# EasyEDA Pro project WaterInfo.eprj

# Schematic 水质信息采集装置原理图
Board Name: 集成原理图; Create Date: 2025-05-13; Page Name: P1; Project Name: WaterInfo; Schematic Name: 水质信息采集装置原理图; Update Date: 2025-05-13; Company: 嘉立创EDA; Drawed: 何宇鹏; Page Size: A4; Version: V2.3
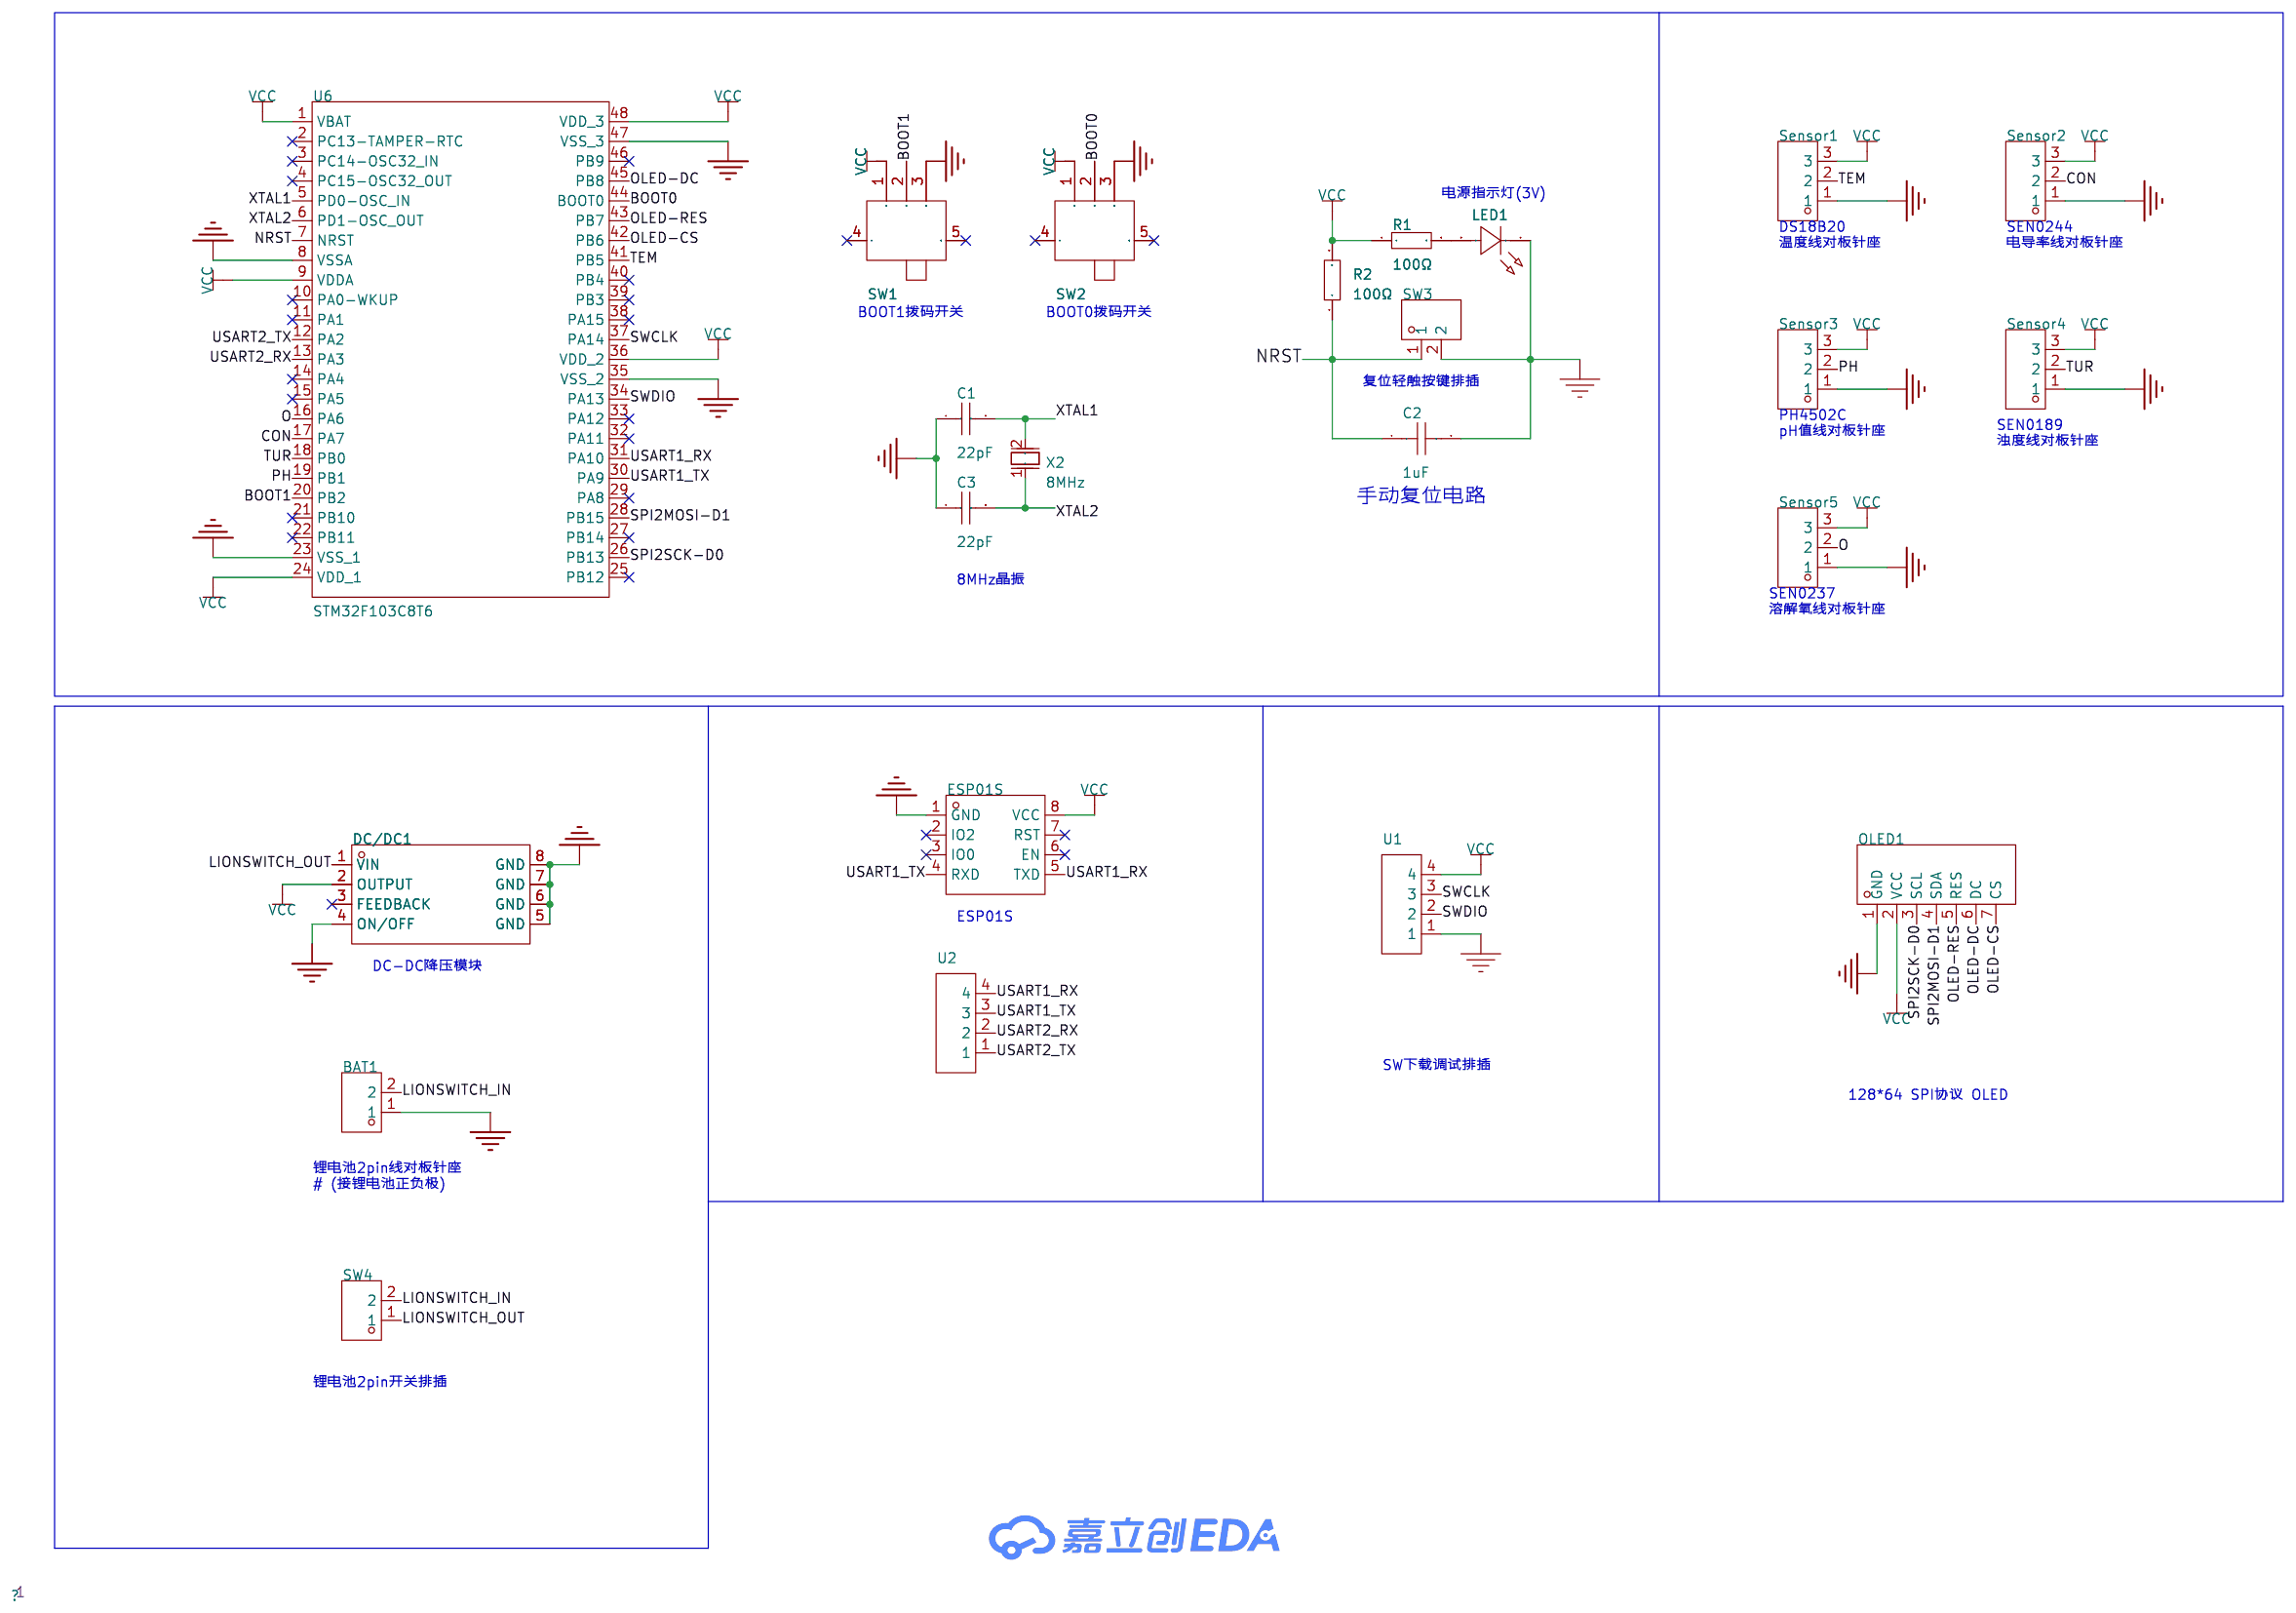
[diagram p0: schematic sheet]

## Parts
BAT1  WAFER-PH2.0-2PZZ  [CONN-TH_2P-P2.00_HC-PH-2A-M]
C1  22pF  [C0603]
C2  1uF  [C0603]
C3  22pF  [C0603]
DC/DC1  XL1509-3.3  [SOIC-8_L4.9-W3.9-P1.27-LS6.0-BL]
ESP01S  2.4GHz  [WIFIM-TH_8P-L24.7-W14.4-P2.54]
LED1  XL-502UGD  [LED-TH_BD5.9-P2.54-RD_GREEN]
OLED1  HS96L01W4S03  [OLED-TH_HS96L01W4S03]
R1  100Ω  [R0805]
R2  100Ω  [R0805]
Sensor1  2.54-1*3P  [CONN-TH_C722693]
Sensor2  WAFER-PH2.0-3PZZ  [CONN-TH_PH2.0D-L-3P]
Sensor3  2.54-1*3P  [CONN-TH_C722693]
Sensor4  WAFER-PH2.0-3PZZ  [CONN-TH_PH2.0D-L-3P]
Sensor5  2.54-1*3P  [CONN-TH_C722693]
SW1  MINI MSK12CO2  [SW-SMD_MSK12CO2]
SW2  MINI MSK12CO2  [SW-SMD_MSK12CO2]
SW3  WAFER-PH2.0-2PZZ  [CONN-TH_2P-P2.00_HC-PH-2A-M]
SW4  WAFER-PH2.0-2PZZ  [CONN-TH_2P-P2.00_HC-PH-2A-M]
U1  HX PZ2.54-1x4P ZZ  [HDR-TH_4P-P2.54-V-M]
U2  HX PZ2.54-1x4P ZZ  [HDR-TH_4P-P2.54-V-M]
U6  STM32F103C8T6  [LQFP-48_L7.0-W7.0-P0.50-LS9.0-BL]
X2  8MHz  [OSC-SMD_2P-L3.2-W2.5]

## Library data of the parts
BAT1 SW3 SW4 = WAFER-PH2.0-2PZZ: LCSC Part Name: 1x2P 间距:2mm 直插 系列:PH; Supplier Part: C5359599; Manufacturer: XUNPU(讯普); Supplier Footprint: 插件,P=2mm; JLCPCB Part Class: 扩展库; Datasheet: https://atta.szlcsc.com/upload/public/pdf/source/20241108/09B74E94153224768C62B7F095CB8C18.pdf; Supplier: LCSC; Pins Structure: 1x2P; Pitch: 2mm; Mounting Type: 直插; Reference Series: PH; Number of Pins: 2P; Number of Rows: 1; Number of PINs Per Row: 2; Current Rating: 2A; Contact Material: 黄铜; Contact Plating: 锡; Operating Temperature: -25℃~+85℃; Voltage Rating: 250V; Plastic Material: PA66; Flame Retardant Rating: UL94V-0; Color: 白色; Z-Height of the Board: 6.05mm; X-Length of Bottom Edge on Board (Spacing Line): 6mm; Y-Width of Bottom Edge on Board: 4.7mm
C1 C3 = CL10C220JB8NNNC: LCSC Part Name: 22pF ±5% 50V; Supplier Part: C1653; Manufacturer: SAMSUNG(三星); Supplier Footprint: 0603; JLCPCB Part Class: 基础库; Datasheet: https://atta.szlcsc.com/upload/public/pdf/source/20160218/1457707763339.pdf; Supplier: LCSC; Tolerance: ±5%; Voltage Rated: 50V; Temperature Coefficient: C0G
C2 = CL10A105KB8NNNC: LCSC Part Name: 1uF ±10% 50V; Supplier Part: C15849; Manufacturer: SAMSUNG(三星); Supplier Footprint: 0603; JLCPCB Part Class: 基础库; Datasheet: https://atta.szlcsc.com/upload/public/pdf/source/20160218/1457707763339.pdf; Supplier: LCSC; Tolerance: ±10%; Voltage Rated: 50V; Temperature Coefficient: X5R
DC/DC1 = XL1509-3.3: LCSC Part Name: 150 KHz 固定频率 PWM 降压 DC/DC 转换器; Supplier Part: C2681226; Manufacturer: UMW(友台半导体); Supplier Footprint: SOP-8; JLCPCB Part Class: 扩展库; Datasheet: https://atta.szlcsc.com/upload/public/pdf/source/20241113/D9907419AB21EE12D855D7DFAFDDCB19.pdf; Supplier: LCSC; Function: 降压型; Output Type: 固定; Input Voltage: 4.5V~40V; Output Voltage: 3.3V; Output Current: 2A; Switching Frequency: 150kHz; Operating Temperature: -40℃~+125℃@(TJ); Synchronous Rectification: 否; Number of Outputs: 1; Topology: 降压式; Quiescent Current (Iq): 150uA; Switch tube (built-in/external): 内置
ESP01S = ESP-01S: LCSC Part Name: 完整的802.11b/g/nWi-FiSoC模块; Supplier Part: C503582; Manufacturer: Ai-Thinker(安信可); JLCPCB Part Class: 扩展库; Datasheet: https://atta.szlcsc.com/upload/public/pdf/source/20200407/C503582_1139AF8FB42E05635FA0089E1752A536.pdf; Supplier: LCSC; Core Processor: ESP8266芯片; Support Interface: GPIO；UART；PWM; Antenna Type: 板载PCB天线; Output Power: 16dBm; Operating Voltage: 3V~3.6V; Receive  Current: 56mA; Send  Current: 170mA; Sensitivity: -90dBm; Operating Temperature: -20℃~+70℃
LED1 = XL-502UGD: Supplier Part: C2895548; Manufacturer: XINGLIGHT(成兴光); Supplier Footprint: 插件,D=5mm; JLCPCB Part Class: 扩展库; Datasheet: https://atta.szlcsc.com/upload/public/pdf/source/20240112/069024ED60A10A0E09F0F24A9490946D.pdf; Supplier: LCSC; Lamp Holder Type: 5mm圆形灯头; Illumination Color: 翠绿色; Voltage - Forward(Vf): 3V; Power(Watts): 70mW; Forward Current: 20mA; Wavelength - Dominant: 520nm~530nm; Peak Wavelength: 520nm; Lens Color: 绿色透镜; Luminous Intensity: 12000mcd; Operating Temperature: -25℃~+85℃
OLED1 = HS96L01W4S03: LCSC Part Name: 0.96寸 白光 128x64像素分辨率; Supplier Part: C5139758; Manufacturer: HS(汉昇); JLCPCB Part Class: 扩展库; Datasheet: https://atta.szlcsc.com/upload/public/pdf/source/20231102/B1697FD352320B8236C71C910449C6BA.pdf; Supplier: LCSC
R1 R2 = RT0805BRD07100RL: LCSC Part Name: 薄膜电阻 100Ω ±0.1% 125mW; Supplier Part: C110773; Manufacturer: YAGEO(国巨); Supplier Footprint: 0805; JLCPCB Part Class: 扩展库; Datasheet: https://atta.szlcsc.com/upload/public/pdf/source/20171113/C136918_15105611010051115495.pdf; Supplier: LCSC; Type: 薄膜电阻; Tolerance: ±0.1%; Power(Watts): 125mW; Overload Voltage (Max): 150V; Temperature Coefficient: ±25ppm/℃; Operating Temperature Range: -55℃~+155℃
Sensor1 Sensor3 Sensor5 = 2.54-1*3P: LCSC Part Name: 1x3P 间距:2.5mm 直插; Supplier Part: C722693; Manufacturer: CAX(创都); Supplier Footprint: 插件,P=2.5mm; JLCPCB Part Class: 扩展库; Datasheet: https://atta.szlcsc.com/upload/public/pdf/source/20200828/C722882_77827A18A6E0E346E9D9EABFEFB0E3A6.pdf; Supplier: LCSC; Pins Structure: 1x3P; Pitch: 2.5mm; Mounting Style: 直插; Number of Pins: 3P; Number of Rows: 1; Number of PINs Per Row: 3; Current Rating (Max): 2A; Operating Temperature Range: -25℃~+85℃
Sensor2 Sensor4 = WAFER-PH2.0-3PZZ: LCSC Part Name: 1x3P 间距:2mm 直插 系列:PH; Supplier Part: C5359600; Manufacturer: XUNPU(讯普); Supplier Footprint: 插件,P=2mm; JLCPCB Part Class: 扩展库; Datasheet: https://atta.szlcsc.com/upload/public/pdf/source/20241108/09B74E94153224768C62B7F095CB8C18.pdf; Supplier: LCSC; Pins Structure: 1x3P; Pitch: 2mm; Mounting Type: 直插; Reference Series: PH; Number of Pins: 3P; Number of Rows: 1; Number of PINs Per Row: 3; Current Rating: 2A; Contact Material: 黄铜; Contact Plating: 锡; Operating Temperature: -25℃~+85℃; Voltage Rating: 250V; Plastic Material: PA66; Flame Retardant Rating: UL94V-0; Color: 白色; Z-Height of the Board: 6.05mm; X-Length of Bottom Edge on Board (Spacing Line): 8mm; Y-Width of Bottom Edge on Board: 4.7mm
SW1 SW2 = MINI MSK12CO2: LCSC Part Name: 迷你七脚两档侧拨拨动 mini七7脚 微型拨动; Supplier Part: C2681570; Manufacturer: SHOU HAN(首韩); Supplier Footprint: SMD; JLCPCB Part Class: 扩展库; Datasheet: https://atta.szlcsc.com/upload/public/pdf/source/20210224/C2681570_D263F9C605E4588A4AE6114B72AE4C72.pdf; Supplier: LCSC; Circuit: 单刀双掷; Pin Style: SMD接片; Switch Length: 5mm; Switch Width: 2.75mm; Switch Height: 1.4mm; Mounting Style: 卧贴; Current Rating (DC): 50mA; Voltage Rating (DC): 12V; Mechanical Life: 1万次; Operating Temperature: -16℃~+60℃
U1 U2 = HX PZ2.54-1x4P ZZ: LCSC Part Name: 1x4P 间距:2.54mm 方针 直插; Supplier Part: C32713270; Manufacturer: hanxia(韩下); Supplier Footprint: 插件,P=2.54mm; JLCPCB Part Class: 扩展库; Datasheet: https://atta.szlcsc.com/upload/public/pdf/source/20240723/FF61E847292D749BB7D110157DA5A2B5.pdf; Supplier: LCSC; Pin Structure: 1x4P; Pitch: 2.54mm; Circluar Pins/Square Pins: 方针; Mounting Type: 直插; Number of Rows: 单排; Number of Pins: 4P; Current Rating: 3A; Length of Mating Pin: 6mm; Insulation Height: 2.5mm; Length of End Connection Pin: 3mm; Contact Material: 黄铜; Contact Plating: 金; Operating Temperature: -40℃~+105℃; Color: 黑色
U6 = STM32F103C8T6: LCSC Part Name: 主流增强型ARM Cortex-M3 MCU，具有64 KB Flash、72 MHz CPU、电机控制、USB和CAN; Supplier Part: C8734; Manufacturer: ST(意法半导体); Supplier Footprint: LQFP-48(7x7); JLCPCB Part Class: 扩展库; Datasheet: https://atta.szlcsc.com/upload/public/pdf/source/20220812/8363ACEC51AD55ECEB84799464F7CB85.pdf; Supplier: LCSC; CPU Core: ARM-M3; CPU Maximum Speed: 72MHz; Program Storage Size: 64KB; Program Memory Type: FLASH; Number of I/O: 37; ADC (Bit): 12bit; Voltage - Supply: 2V~3.6V
X2 = A308000003: LCSC Part Name: FL:8M CL:12.0 FT:30 OP:-40TO~125 ST:100 CI:300 DL:10(100Max); Supplier Part: C409345; Manufacturer: TXC(晶技); Supplier Footprint: SMD3225; JLCPCB Part Class: 扩展库; Datasheet: https://atta.szlcsc.com/upload/public/pdf/source/20240312/351197091BF4DB9A6E687BFC8ED82776.pdf; Supplier: LCSC; Type: 贴片晶振; Normal temperature Frequency Tolerance: ±30ppm; Load Capacitance: 12pF; Equivalent Series Resistance(ESR): 300Ω; Operating Temperature: -40℃~+125℃

## Nets
GND: BAT1.1 C1.1 C2.2 C3.1 DC/DC1.4(ON/OFF) DC/DC1.5(GND) DC/DC1.6(GND) DC/DC1.7(GND) DC/DC1.8(GND) ESP01S.1(GND) LED1.1(K) OLED1.1(GND) Sensor1.1 Sensor2.1 Sensor3.1 Sensor4.1 Sensor5.1 SW1.3 SW2.3 SW3.2 U1.1 U6.8(VSSA) U6.23(VSS_1) U6.35(VSS_2) U6.47(VSS_3)
VCC: DC/DC1.2(OUTPUT) ESP01S.8(VCC) OLED1.2(VCC) R1.1 R2.2 Sensor1.3 Sensor2.3 Sensor3.3 Sensor4.3 Sensor5.3 SW1.1 SW2.1 U1.4 U6.1(VBAT) U6.9(VDDA) U6.24(VDD_1) U6.36(VDD_2) U6.48(VDD_3)
BOOT0: SW2.2 U6.44(BOOT0)
BOOT1: SW1.2 U6.20(PB2)
CON: Sensor2.2 U6.17(PA7)
LIONSWITCH_IN: BAT1.2 SW4.2
LIONSWITCH_OUT: DC/DC1.1(VIN) SW4.1
NRST: C2.1 R2.1 SW3.1 U6.7(NRST)
O: Sensor5.2 U6.16(PA6)
OLED-CS: OLED1.7(CS) U6.42(PB6)
OLED-DC: OLED1.6(DC) U6.45(PB8)
OLED-RES: OLED1.5(RES) U6.43(PB7)
PH: Sensor3.2 U6.19(PB1)
SPI2MOSI-D1: OLED1.4(SDA) U6.28(PB15)
SPI2SCK-D0: OLED1.3(SCL) U6.26(PB13)
SWCLK: U1.3 U6.37(PA14)
SWDIO: U1.2 U6.34(PA13)
TEM: Sensor1.2 U6.41(PB5)
TUR: Sensor4.2 U6.18(PB0)
USART1_RX: ESP01S.5(TXD) U2.4 U6.31(PA10)
USART1_TX: ESP01S.4(RXD) U2.3 U6.30(PA9)
USART2_RX: U2.2 U6.13(PA3)
USART2_TX: U2.1 U6.12(PA2)
XTAL1: C1.2 U6.5(PD0-OSC_IN) X2.2
XTAL2: C3.2 U6.6(PD1-OSC_OUT) X2.1
$1N4511: LED1.2(A) R1.2

Not connected (* = marked no-connect by the designer): DC/DC1 3(FEEDBACK)*; ESP01S 2(IO2)* 3(IO0)* 6(EN)* 7(RST)*; SW1 4* 5*; SW2 4* 5*; U6 2(PC13-TAMPER-RTC)* 3(PC14-OSC32_IN)* 4(PC15-OSC32_OUT)* 10(PA0-WKUP)* 11(PA1)* 14(PA4)* 15(PA5)* 21(PB10)* 22(PB11)* 25(PB12)* 27(PB14)* 29(PA8)* 32(PA11)* 33(PA12)* 38(PA15)* 39(PB3)* 40(PB4)* 46(PB9)*

## Notes on the sheet
- 电源指示灯(3V)
- DS18B20
  温度线对板针座
- SEN0244
  电导率线对板针座
- BOOT1拨码开关
- BOOT0拨码开关
- 复位轻触按键排插
- PH4502C
  pH值线对板针座
- SEN0189
  浊度线对板针座
- 手动复位电路
- 8MHz晶振
- SEN0237
  溶解氧线对板针座
- ESP01S
- DC-DC降压模块
- SW下载调试排插
- 128*64 SPI协议 OLED
- 锂电池2pin线对板针座
  # (接锂电池正负极)
- 锂电池2pin开关排插

# Board WaterInfo
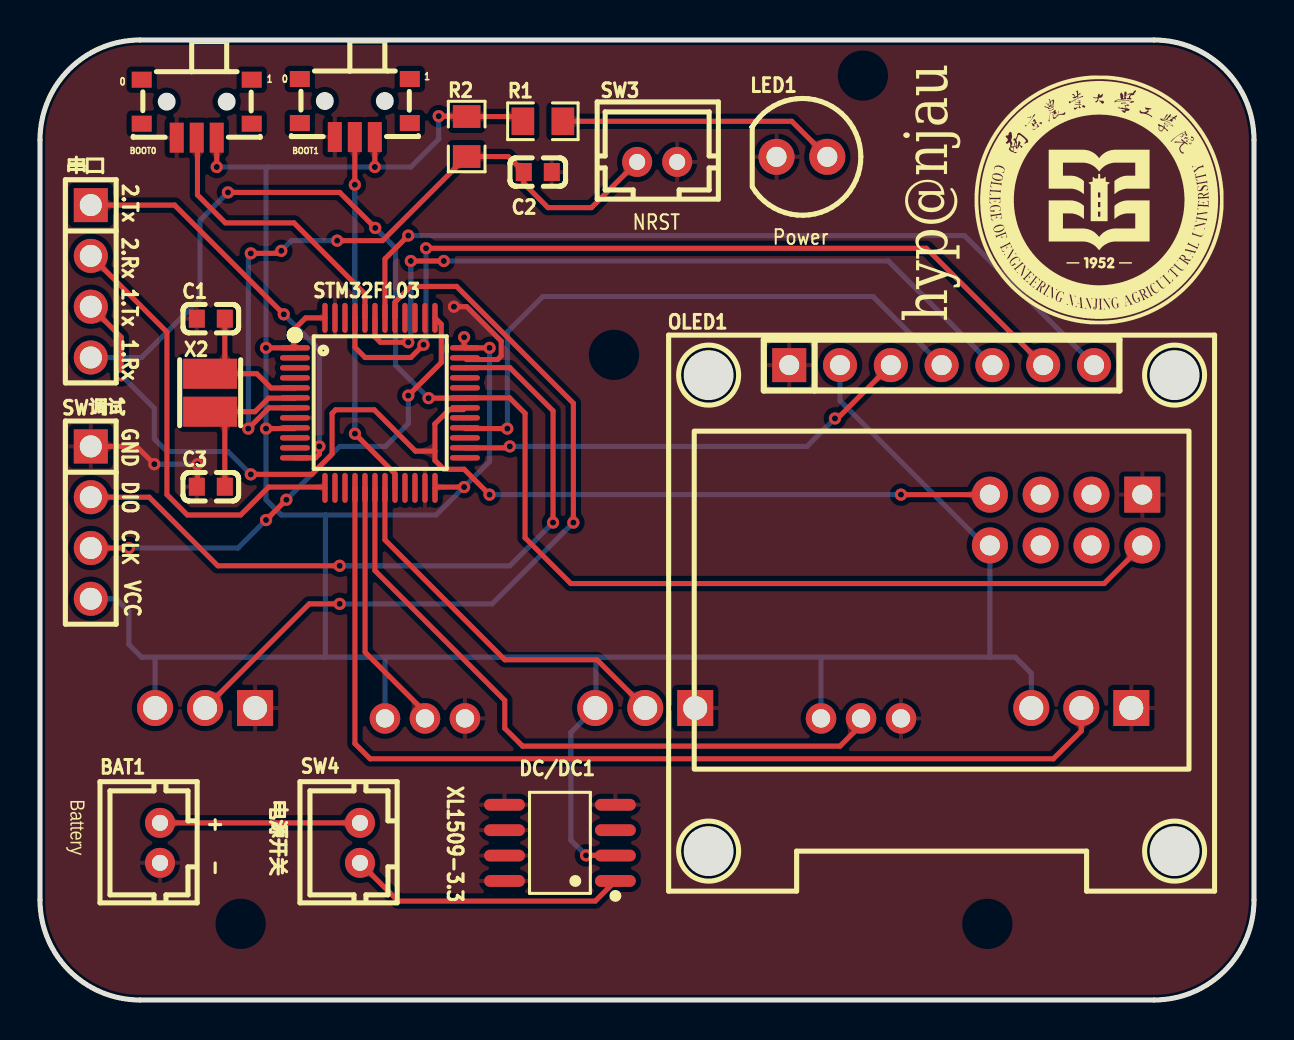
[diagram p1: board, top side]
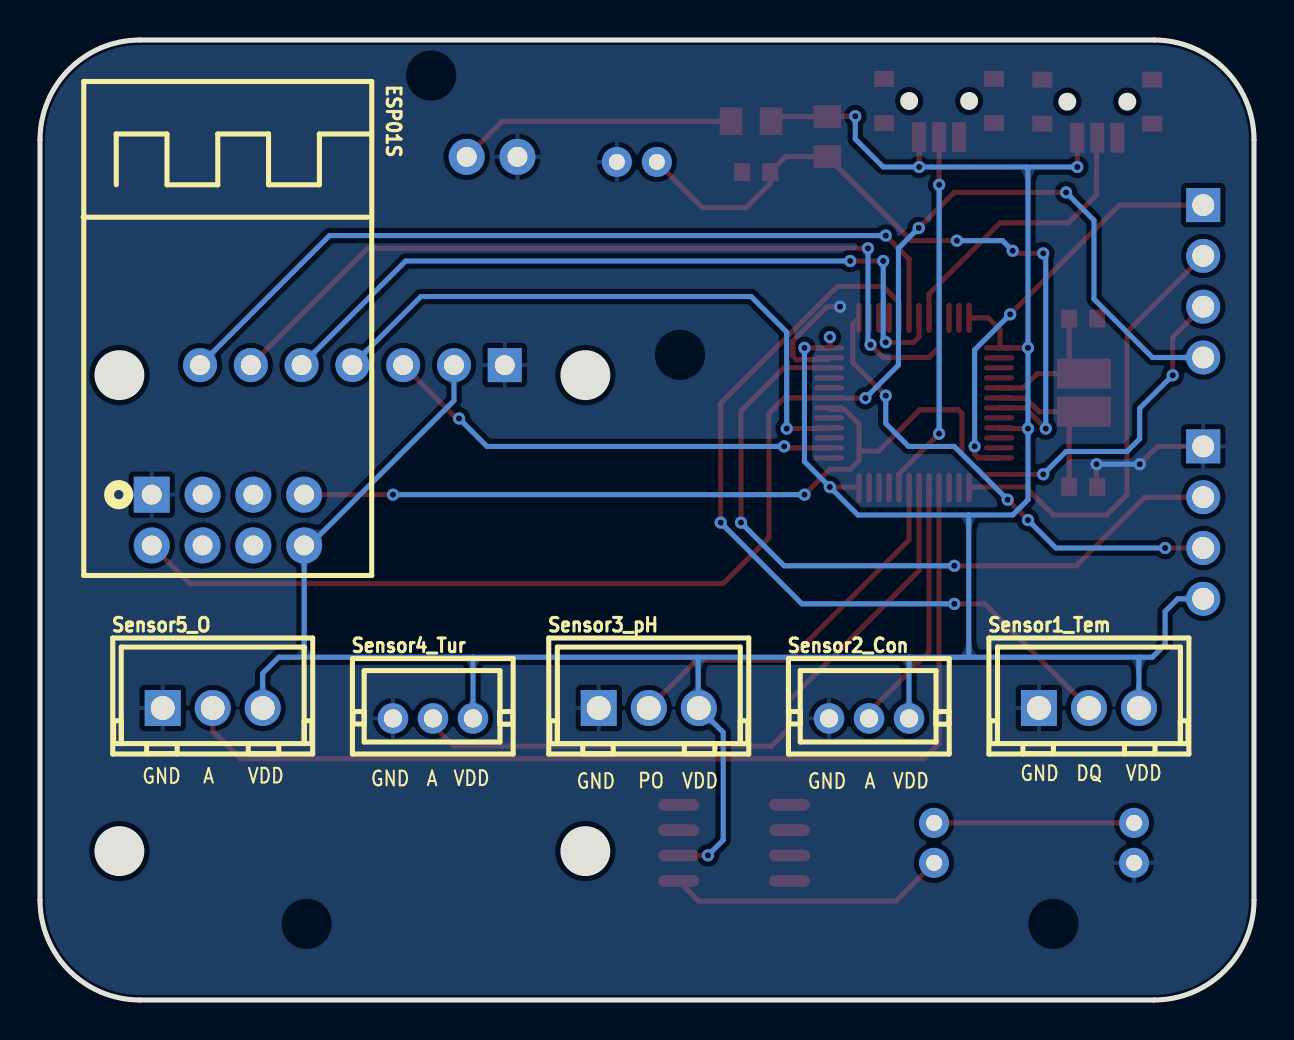
[diagram p2: board, bottom side, seen from below]

Outline 60.71 x 48 mm; copper layers: Top Layer, Bottom Layer. Coordinates in mm from the lower left corner of the outline.
Outline path: 0,43 0,5 arc(1.46,1.46) 5,0 55.71,0 arc(59.24,1.46) 60.71,5 60.71,43 arc(59.24,46.54) 55.71,48 5,48 arc(1.46,46.54) 0,43
Stack: Top Layer 0.035mm / Dielectric1 1.51mm FR4 er 4.5 / Bottom Layer 0.035mm

## Design rules (mm)
template: JLCPCB Capability(Two Layers Board)
spacing copperThickness1oz (default): track to track 0.102, other pairs 0.152 to 0.3
spacing copperThickness2oz: track to track 0.203, other pairs 0.152 to 0.3
track width copperThickness1oz (default): min 0.127, default 0.254, max 2.54
track width copperThickness2oz: min 0.203, default 0.254, max 2.54
differential pair differentialPair (default): width min 0.127, default 0.254, max 2.54; gap min 0.152, default 0.152
via viaSize (default): diameter min 0.5, default 0.61, max 10; hole min 0.3, default 0.305, max 6.3

## Placement (name value [footprint] x y rotation side)
BAT1  WAFER-PH2.0-2PZZ  [CONN-TH_2P-P2.00_HC-PH-2A-M]  6 7.86 90 top
BOOT0  MINI MSK12CO2  [SW-SMD_MSK12CO2]  7.84 44.57 180 top
BOOT1  MINI MSK12CO2  [SW-SMD_MSK12CO2]  15.74 44.6 180 top
C1  22pF  [C0603]  8.54 34.07 0 top
C2  1uF  [C0603]  24.89 41.4 0 top
C3  22pF  [C0603]  8.54 25.66 0 top
DC/DC1  XL1509-3.3  [SOIC-8_L4.9-W3.9-P1.27-LS6.0-BL]  26 7.86 90 top
ESP01S  2.4GHz  [WIFIM-TH_8P-L24.7-W14.4-P2.54]  51.31 24 90 bottom
LED1  XL-502UGD  [LED-TH_BD5.9-P2.54-RD_GREEN]  38.1 42.16 0 top
OLED1  HS96L01W4S03  [OLED-TH_HS96L01W4S03]  45.09 31.74 0 top
R1  100Ω  [R0805]  25.15 43.94 0 top
R2  100Ω  [R0805]  21.34 43.17 90 top
Sensor1_Tem  2.54-1*3P  [CONN-TH_C722693]  8.25 14.6 180 bottom
Sensor2_Con  WAFER-PH2.0-3PZZ  [CONN-TH_PH2.0D-L-3P]  19.25 14.08 180 bottom
Sensor3_pH  2.54-1*3P  [CONN-TH_C722693]  30.26 14.6 180 bottom
Sensor4_Tur  WAFER-PH2.0-3PZZ  [CONN-TH_PH2.0D-L-3P]  41.06 14.08 180 bottom
Sensor5_O  2.54-1*3P  [CONN-TH_C722693]  52.07 14.6 180 bottom
STM32F103  STM32F103C8T6  [LQFP-48_L7.0-W7.0-P0.50-LS9.0-BL]  17 29.86 270 top
SW3  WAFER-PH2.0-2PZZ  [CONN-TH_2P-P2.00_HC-PH-2A-M]  30.86 41.9 0 top
SW4  WAFER-PH2.0-2PZZ  [CONN-TH_2P-P2.00_HC-PH-2A-M]  16 7.86 90 top
SW调试  HX PZ2.54-1x4P ZZ  [HDR-TH_4P-P2.54-V-M]  2.54 23.87 270 top
X2  8MHz  [OSC-SMD_2P-L3.2-W2.5]  8.51 30.36 270 top
串口  HX PZ2.54-1x4P ZZ  [HDR-TH_4P-P2.54-V-M]  2.54 35.94 270 top

## Footprints (pads in the part's own frame, mm; a bottom-side part is the same pattern mirrored in y, then rotated)
C0603
  rect 0.8x0.9 smd: 1(-0.7,0) 2(0.7,0)
CONN-TH_2P-P2.00_HC-PH-2A-M
  round 1.5 hole 0.8: 1(-1,0) 2(1,0)
CONN-TH_C722693
  rect 1.8x1.8 hole 1.2: 1(-2.5,0)
  round 1.8 hole 1.2: 2(0,0) 3(2.5,0)
CONN-TH_PH2.0D-L-3P
  round 1.524 hole 0.914: 1(-2,0) 2(0,0) 3(2,0)
HDR-TH_4P-P2.54-V-M
  rect 1.7x1.7 hole 1.1: 1(-3.81,0)
  round 1.7 hole 1.1: 2(-1.27,0) 3(1.27,0) 4(3.81,0)
LED-TH_BD5.9-P2.54-RD_GREEN
  round 1.8 hole 1: 1(-1.27,0) 2(1.27,0)
LQFP-48_L7.0-W7.0-P0.50-LS9.0-BL
  oval 0.27x1.5 smd: 1(-2.75,-4.25) 2(-2.25,-4.25) 3(-1.75,-4.25) 4(-1.25,-4.25) 5(-0.75,-4.25) 6(-0.25,-4.25) 7(0.25,-4.25) 8(0.75,-4.25) 9(1.25,-4.25) 10(1.75,-4.25) 11(2.25,-4.25) 12(2.75,-4.25) 25(2.75,4.25) 26(2.25,4.25) 27(1.75,4.25) 28(1.25,4.25) 29(0.75,4.25) 30(0.25,4.25) 31(-0.25,4.25) 32(-0.75,4.25) 33(-1.25,4.25) 34(-1.75,4.25) 35(-2.25,4.25) 36(-2.75,4.25)
  oval 1.5x0.27 smd: 13(4.25,-2.75) 14(4.25,-2.25) 15(4.25,-1.75) 16(4.25,-1.25) 17(4.25,-0.75) 18(4.25,-0.25) 19(4.25,0.25) 20(4.25,0.75) 21(4.25,1.25) 22(4.25,1.75) 23(4.25,2.25) 24(4.25,2.75) 37(-4.25,2.75) 38(-4.25,2.25) 39(-4.25,1.75) 40(-4.25,1.25) 41(-4.25,0.75) 42(-4.25,0.25) 43(-4.25,-0.25) 44(-4.25,-0.75) 45(-4.25,-1.25) 46(-4.25,-1.75) 47(-4.25,-2.25) 48(-4.25,-2.75)
OLED-TH_HS96L01W4S03
  rect 1.7x1.7 hole 1: 1(-7.62,0)
  round 1.7 hole 1: 2(-5.08,0) 3(-2.54,0) 4(0,0) 5(2.54,0) 6(5.08,0) 7(7.62,0)
OSC-SMD_2P-L3.2-W2.5
  rect 1.5x2.7 smd: 1(0.95,0) 2(-0.95,0)
R0805
  rect 1.133x1.377 smd: 1(-1,0) 2(1,0)
SOIC-8_L4.9-W3.9-P1.27-LS6.0-BL
  oval 0.588x2.045 smd: 1(-1.905,-2.772) 2(-0.635,-2.772) 3(0.635,-2.772) 4(1.905,-2.772) 5(1.905,2.772) 6(0.635,2.772) 7(-0.635,2.772) 8(-1.905,2.772)
SW-SMD_MSK12CO2
  rect 0.7x1.5 smd: 1(-1,1.45) 2(0,1.45) 3(1,1.45)
  rect 1x0.8 smd: 4(-2.75,0.75) 4(-2.75,-1.45) 5(2.75,0.75) 5(2.75,-1.45)
WIFIM-TH_8P-L24.7-W14.4-P2.54
  rect 1.8x1.8 hole 1: 1(1.27,3.81)
  round 1.8 hole 1: 2(1.27,1.27) 3(1.27,-1.27) 4(1.27,-3.81) 5(-1.27,3.81) 6(-1.27,1.27) 7(-1.27,-1.27) 8(-1.27,-3.81)

## Nets
GND: BAT1.1 BOOT0.3 BOOT1.3 C1.1 C2.2 C3.1 DC/DC1.4 DC/DC1.5 DC/DC1.6 DC/DC1.7 DC/DC1.8 ESP01S.1 LED1.1 OLED1.1 Sensor1_Tem.1 Sensor2_Con.1 Sensor3_pH.1 Sensor4_Tur.1 Sensor5_O.1 STM32F103.8 STM32F103.23 STM32F103.35 STM32F103.47 SW3.2 SW调试.1
VCC: BOOT0.1 BOOT1.1 DC/DC1.2 ESP01S.8 OLED1.2 R1.1 R2.2 Sensor1_Tem.3 Sensor2_Con.3 Sensor3_pH.3 Sensor4_Tur.3 Sensor5_O.3 STM32F103.1 STM32F103.9 STM32F103.24 STM32F103.36 STM32F103.48 SW调试.4
BOOT0: BOOT0.2 STM32F103.44
BOOT1: BOOT1.2 STM32F103.20
CON: Sensor2_Con.2 STM32F103.17
LIONSWITCH_IN: BAT1.2 SW4.2
LIONSWITCH_OUT: DC/DC1.1 SW4.1
NRST: C2.1 R2.1 STM32F103.7 SW3.1
O: Sensor5_O.2 STM32F103.16
OLED-CS: OLED1.7 STM32F103.42
OLED-DC: OLED1.6 STM32F103.45
OLED-RES: OLED1.5 STM32F103.43
PH: Sensor3_pH.2 STM32F103.19
SPI2MOSI-D1: OLED1.4 STM32F103.28
SPI2SCK-D0: OLED1.3 STM32F103.26
SWCLK: STM32F103.37 SW调试.3
SWDIO: STM32F103.34 SW调试.2
TEM: Sensor1_Tem.2 STM32F103.41
TUR: Sensor4_Tur.2 STM32F103.18
USART1_RX: ESP01S.5 STM32F103.31 串口.4
USART1_TX: ESP01S.4 STM32F103.30 串口.3
USART2_RX: STM32F103.13 串口.2
USART2_TX: STM32F103.12 串口.1
XTAL1: C1.2 STM32F103.5 X2.2
XTAL2: C3.2 STM32F103.6 X2.1
$1N4511: LED1.2 R1.2

Pads without a net: BOOT0 4 5; BOOT1 4 5; DC/DC1 3; ESP01S 2 3 6 7; STM32F103 2 3 4 10 11 14 15 21 22 25 27 29 32 33 38 39 40 46

## Via types
v1: diameter 0.61, hole 0.305, Top Layer to Bottom Layer, 44 vias

## Routing (per net, layer and track width the routed paths; a pad name or vN(x,y) marks a point on that pad's centre or on a via; arc(x,y) is an arc through that point)
GND: length 12.6
  Top Layer w0.254: v1(20.7,34.67) 21.34,34.67 23.06,32.94 23.06,32.2 22.88,32.02 21.33,32.02 STM32F103.35 ; v1(7.87,26.79) 7.87,25.69 C3.1 ; SW调试.1 4.83,27.68 v1(5.72,26.79)
  Bottom Layer w0.254: v1(5.72,26.79) v1(7.87,26.79)
VCC: length 161
  Top Layer w0.254: STM32F103.24 19.79,25.65 v1(21.21,25.65) ; v1(11.3,32.61) STM32F103.1 12.7,32.66 12.7,33.52 13.28,34.11 STM32F103.48 ; v1(19.94,44.19) 21.32,44.19 R2.2 23.91,44.17 R1.1 ; DC/DC1.2 28.76,7.23 v1(27.31,7.23) ; v1(11.3,28.57) 12.71,28.57 STM32F103.9 ; v1(21.21,33.14) 21.21,32.65 STM32F103.36 v1(22.48,32.61) ; 8.84,43.12 v1(8.84,41.65) ; BOOT1.1 v1(16.74,41.65)
  Bottom Layer w0.254: OLED1.2 40,29.97 47.24,22.73 ESP01S.8 47.5,17.14 47.49,17.14 ; 14.26,24.25 19.81,24.25 v1(21.21,25.65) 22.48,26.92 v1(22.48,32.61) ; 14.26,24.25 14.26,17.19 14.21,17.14 ; 14.26,24.25 12.06,24.25 11.3,25.01 v1(11.3,28.57) v1(11.3,32.61) 11.3,41.57 11.39,41.65 ; 27.8,17.14 17.26,17.14 ; 27.8,17.14 27.8,14.63 Sensor3_pH.3 26.54,13.38 26.54,8 v1(27.31,7.23) ; 27.8,17.14 39.06,17.14 ; 17.26,17.14 17.25,17.13 Sensor2_Con.3 ; 17.26,17.14 14.21,17.14 ; 47.49,17.14 39.06,17.14 ; 47.49,17.14 48.77,17.14 49.57,16.34 Sensor5_O.3 ; 39.06,17.14 39.06,17.14 Sensor4_Tur.3 ; 2.67,20.06 3.81,20.06 4.44,19.42 4.44,17.77 5.08,17.14 5.72,17.14 ; v1(19.94,44.19) 19.94,43.05 18.54,41.65 v1(16.74,41.65) 11.39,41.65 ; 11.39,41.65 v1(8.84,41.65) ; 14.21,17.14 5.72,17.14 ; Sensor1_Tem.3 5.75,17.1 5.72,17.14
BOOT0: length 14.5
  Top Layer w0.254: STM32F103.44 16.25,35.31 12.7,38.86 9.27,38.86 7.87,40.25 7.87,43.08 7.84,43.12
BOOT1: length 18.4
  Top Layer w0.254: BOOT1.2 v1(15.74,40.76) ; STM32F103.20 17.75,26.31 v1(15.75,28.31)
  Bottom Layer w0.254: v1(15.75,28.31) 15.74,28.32 v1(15.74,40.76)
CON: length 12.8
  Top Layer w0.254: Sensor2_Con.2 19.25,14.4 16.26,17.39 16.26,25.6 STM32F103.17
LIONSWITCH_IN: length 10
  Top Layer w0.254: BAT1.2 SW4.2
LIONSWITCH_OUT: length 14
  Top Layer w0.254: DC/DC1.1 27.77,4.95 17.91,4.95 SW4.1
NRST: length 35.2
  Top Layer w0.254: v1(10.41,28.57) 11.45,29.61 STM32F103.7 ; v1(10.54,37.33) 11.94,37.33 v1(12.06,37.46) ; v1(14.86,37.97) 17.13,37.97 R2.1 23.41,42.17 C2.1 24.19,40.83 25.4,39.62 27.57,39.62 SW3.1
  Bottom Layer w0.254: v1(12.06,37.46) 12.57,37.97 v1(14.86,37.97) ; v1(10.41,28.57) 10.41,37.2 v1(10.54,37.33)
O: length 51.1
  Top Layer w0.254: Sensor5_O.2 52.07,13.46 50.67,12.06 16.51,12.06 15.75,12.82 STM32F103.16
OLED-CS: length 41.6
  Top Layer w0.254: v1(18.41,38.22) 17.25,37.06 STM32F103.42
  Bottom Layer w0.254: v1(18.41,38.22) 46.23,38.22 OLED1.7
OLED-DC: length 43.5
  Top Layer w0.254: v1(19.3,37.59) 44.32,37.59 50.16,31.74 ; STM32F103.45 15.75,34.11 15.75,32.63 16.26,32.12 18.54,32.12 v1(19.18,32.76)
  Bottom Layer w0.254: v1(19.3,37.59) 19.3,32.89 v1(19.18,32.76)
OLED-RES: length 38.1
  Top Layer w0.254: v1(18.41,32.89) 17.02,32.89 16.75,33.16 STM32F103.43 ; v1(20.19,36.95) v1(18.54,36.95)
  Bottom Layer w0.254: v1(18.54,36.95) 18.54,33.01 v1(18.41,32.89) ; OLED1.5 42.42,36.95 v1(20.19,36.95)
PH: length 19.1
  Top Layer w0.254: Sensor3_pH.2 27.85,17.01 23.24,17.01 17.25,23 STM32F103.19
SPI2MOSI-D1: length 30.8
  Top Layer w0.254: STM32F103.28 21.29,28.57 v1(23.37,28.57)
  Bottom Layer w0.254: OLED1.4 41.66,35.17 25.15,35.17 23.37,33.39 v1(23.37,28.57)
SPI2SCK-D0: length 23
  Top Layer w0.254: v1(23.5,27.68) 23.42,27.61 STM32F103.26 ; v1(39.75,29.08) 39.88,29.08 42.54,31.74
  Bottom Layer w0.254: v1(23.5,27.68) 38.35,27.68 v1(39.75,29.08)
SWCLK: length 24.4
  Top Layer w0.254: v1(11.3,24) v1(12.32,25.01) ; 2.67,22.6 v1(4.44,22.6) ; v1(18.41,30.22) 20.07,31.87 20.07,33.79 STM32F103.37
  Bottom Layer w0.254: v1(12.32,25.01) 14.99,27.68 17.27,27.68 18.41,28.82 v1(18.41,30.22) ; v1(4.44,22.6) 9.91,22.6 v1(11.3,24)
SWDIO: length 36.2
  Top Layer w0.254: v1(25.65,23.87) 25.65,29.46 23.5,31.62 21.26,31.62 STM32F103.34 ; v1(14.99,21.71) 8.89,21.71 5.46,25.14 2.67,25.14
  Bottom Layer w0.254: v1(14.99,21.71) 23.5,21.71 v1(25.65,23.87)
TEM: length 40.7
  Top Layer w0.254: STM32F103.41 17.75,34.89 18.54,35.68 20.83,35.68 26.67,29.84 v1(26.67,23.87) ; Sensor1_Tem.2 13.46,19.81 v1(14.99,19.81)
  Bottom Layer w0.254: v1(26.67,23.87) 22.61,19.81 v1(14.99,19.81)
TUR: length 33.7
  Top Layer w0.254: STM32F103.18 16.75,21.47 23.24,14.98 23.24,13.58 24.13,12.69 40,12.69 41.06,13.74 Sensor4_Tur.2
USART1_RX: length 74.3
  Top Layer w0.254: ESP01S.5 53.21,20.82 26.54,20.82 24.26,23.11 24.26,29.33 23.48,30.11 STM32F103.31 21.24,30.09 v1(19.43,30.09) ; v1(9.4,40.38) 14.99,40.38 v1(16.76,38.6)
  Bottom Layer w0.254: v1(19.43,30.09) 17.78,31.74 17.78,37.59 v1(16.76,38.6) ; v1(9.4,40.38) 8,38.98 8,35.05 5.08,32.12 串口.4
USART1_TX: length 58.2
  Top Layer w0.254: v1(10.54,26.28) 13.59,26.28 14.6,27.3 14.6,29.33 14.78,29.51 16.71,29.51 18.78,27.44 19.75,27.44 ; 19.75,27.44 19.75,26.98 20.19,26.54 21.21,26.54 v1(22.48,25.27) ; 19.75,27.44 19.75,28.81 20.46,29.52 21.16,29.52 STM32F103.30 ; 串口.3 4.06,33.14 v1(4.06,31.24) ; ESP01S.4 v1(43.05,25.27)
  Bottom Layer w0.254: v1(4.06,31.24) 5.72,29.58 5.72,28.06 6.35,27.43 9.4,27.43 v1(10.54,26.28) ; v1(43.05,25.27) v1(22.48,25.27)
USART2_RX: length 22.4
  Top Layer w0.254: 串口.2 6.35,33.39 6.35,25.27 7.37,24.25 10.03,24.25 11.43,25.65 14.21,25.65 STM32F103.13
USART2_TX: length 20.9
  Top Layer w0.254: 串口.1 6.73,39.75 v1(12.19,34.28) ; STM32F103.12 13.78,27.11 13.97,27.3 v1(13.97,27.68)
  Bottom Layer w0.254: v1(12.19,34.28) 13.97,32.51 v1(13.97,27.68)
XTAL1: length 7.4
  Top Layer w0.254: 9.02,31.31 10.84,31.31 11.56,30.6 12.74,30.6 STM32F103.5 ; 9.02,31.31 9.24,31.54 C1.2 ; 9.02,31.31 X2.2
XTAL2: length 8.3
  Top Layer w0.254: C3.2 9.24,29.36 9.19,29.42 ; 9.19,29.42 X2.1 ; 9.19,29.42 10.75,29.42 11.43,30.09 12.74,30.09 STM32F103.6
$1N4511: length 14
  Top Layer w0.254: LED1.2 37.59,43.94 R1.2

## Copper pours and planes (outline as drawn; the poured copper is in the pictures)
GND on Top Layer: -1.65,49.78 62.74,49.78 62.74,-1.53 -1.65,-1.53
GND on Bottom Layer: -6.1,53.84 67.18,53.84 67.18,-2.93 -6.1,-2.93

Small or netless copper shapes (teardrops, artwork), in the pictures only: 98 on Top Layer, 67 on Bottom Layer

## Text on the board
Bottom Silkscreen Layer: VDD | DQ | GND | A | PO
Top Silkscreen Layer: 0 | 1 | NRST | Power | 2.Rx | 1.Tx | 1.Rx | GND | 2.Tx | DIO | CLK | VCC | + | - | XL1509-3.3 | Battery | hyp@njau | 电源开关
